# Altium schematic sheet Sheet2.SchDoc
size A3
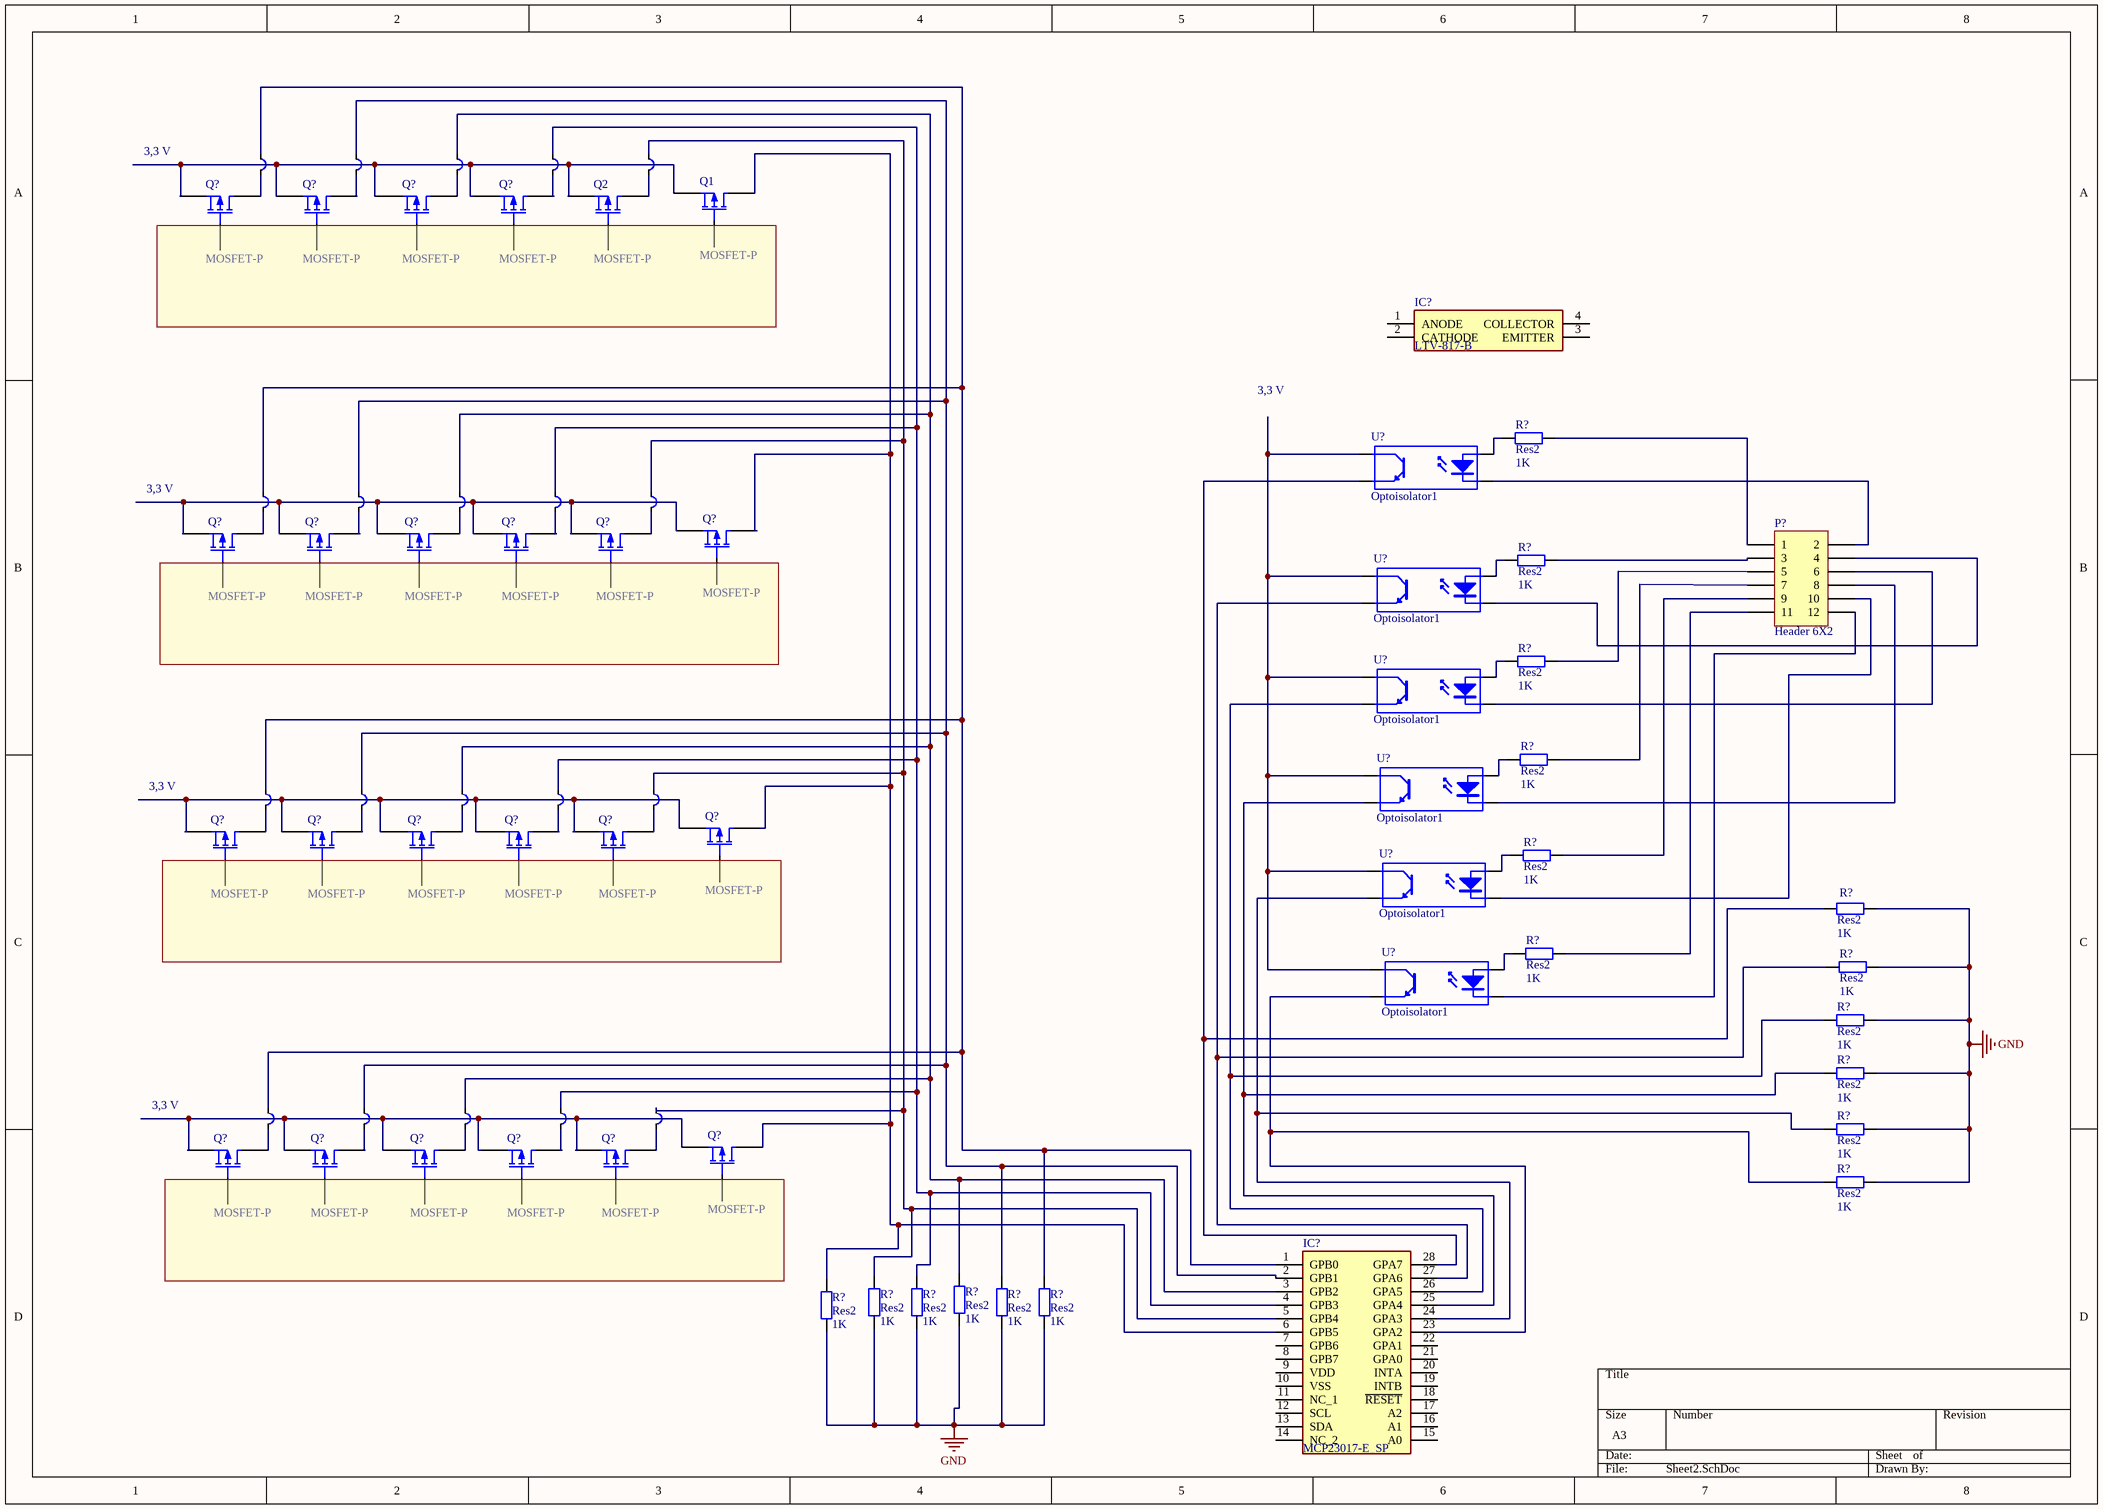
[diagram p0: Sheet2.SchDoc]

## Parts
(Parts that share a designator on the sheet are numbered #1, #2 ... from top to bottom, then left to right.)
*  wire_lope  (value not drawn)
*?#1  wire_lope  (value not drawn)
*?#2  wire_lope  (value not drawn)
*?#3  wire_lope  (value not drawn)
*?#4  wire_lope  (value not drawn)
*?#5  wire_lope  (value not drawn)
*?#6  wire_lope  (value not drawn)
*?#7  wire_lope  (value not drawn)
*?#8  wire_lope  (value not drawn)
*?#9  wire_lope  (value not drawn)
*?#10  wire_lope  (value not drawn)
*?#11  wire_lope  (value not drawn)
*?#12  wire_lope  (value not drawn)
*?#13  wire_lope  (value not drawn)
*?#14  wire_lope  (value not drawn)
*?#15  wire_lope  (value not drawn)
*?#16  wire_lope  (value not drawn)
*?#17  wire_lope  (value not drawn)
*?#18  wire_lope  (value not drawn)
*?#19  wire_lope  (value not drawn)
IC?#1  LTV-817-B  [DIP762W60P254L460H420Q4N]
IC?#2  MCP23017-E_SP  [DIP794W56P254L3486H508Q28N]
P?  Header 6X2  [HDR2X6]
Q1  MOSFET-P  [E3]
Q2  MOSFET-P  [E3]
Q?#1  MOSFET-P  [E3]
Q?#2  MOSFET-P  [E3]
Q?#3  MOSFET-P  [E3]
Q?#4  MOSFET-P  [E3]
Q?#5  MOSFET-P  [E3]
Q?#6  MOSFET-P  [E3]
Q?#7  MOSFET-P  [E3]
Q?#8  MOSFET-P  [E3]
Q?#9  MOSFET-P  [E3]
Q?#10  MOSFET-P  [E3]
Q?#11  MOSFET-P  [E3]
Q?#12  MOSFET-P  [E3]
Q?#13  MOSFET-P  [E3]
Q?#14  MOSFET-P  [E3]
Q?#15  MOSFET-P  [E3]
Q?#16  MOSFET-P  [E3]
Q?#17  MOSFET-P  [E3]
Q?#18  MOSFET-P  [E3]
Q?#19  MOSFET-P  [E3]
Q?#20  MOSFET-P  [E3]
Q?#21  MOSFET-P  [E3]
Q?#22  MOSFET-P  [E3]
R?#1  Res2  value 1K  [AXIAL-0.4]
R?#2  Res2  value 1K  [AXIAL-0.4]
R?#3  Res2  value 1K  [AXIAL-0.4]
R?#4  Res2  value 1K  [AXIAL-0.4]
R?#5  Res2  value 1K  [AXIAL-0.4]
R?#6  Res2  value 1K  [AXIAL-0.4]
R?#7  Res2  value 1K  [AXIAL-0.4]
R?#8  Res2  value 1K  [AXIAL-0.4]
R?#9  Res2  value 1K  [AXIAL-0.4]
R?#10  Res2  value 1K  [AXIAL-0.4]
R?#11  Res2  value 1K  [AXIAL-0.4]
R?#12  Res2  value 1K  [AXIAL-0.4]
R?#13  Res2  value 1K  [AXIAL-0.4]
R?#14  Res2  value 1K  [AXIAL-0.4]
R?#15  Res2  value 1K  [AXIAL-0.4]
R?#16  Res2  value 1K  [AXIAL-0.4]
R?#17  Res2  value 1K  [AXIAL-0.4]
R?#18  Res2  value 1K  [AXIAL-0.4]
U?#1  Optoisolator1  [DIP-4]
U?#2  Optoisolator1  [DIP-4]
U?#3  Optoisolator1  [DIP-4]
U?#4  Optoisolator1  [DIP-4]
U?#5  Optoisolator1  [DIP-4]
U?#6  Optoisolator1  [DIP-4]

## Nets
GND: R?#6.1 R?#8.1 R?#9.1 R?#10.1 R?#11.1 R?#12.1 R?#13.1 R?#14.1 R?#15.1 R?#16.1 R?#17.1 R?#18.1
Net*?#1_6: *?#1.6 *?#5.6 *?#10.6 *?#15.6 IC?#2.1(GPB0) R?#17.2
Net*?#1_7: *?#1.7 Q?#1.1(D)
Net*?#2_6: *?#2.6 *?#6.6 *?#11.6 *?#16.6 IC?#2.2(GPB1) R?#16.2
Net*?#2_7: *?#2.7 Q?#2.1(D)
Net*?#3_6: *?#3.6 *?#7.6 *?#12.6 *?#17.6 IC?#2.3(GPB2) R?#15.2
Net*?#3_7: *?#3.7 Q?#3.1(D)
Net*?#4_6: *?#4.6 *?#9.6 *?#14.6 *?#19.6 IC?#2.5(GPB4) R?#13.2
Net*?#4_7: *?#4.7 Q2.1(D)
Net*?#5_7: *?#5.7 Q?#5.1(D)
Net*?#6_7: *?#6.7 Q?#6.1(D)
Net*?#7_7: *?#7.7 Q?#7.1(D)
Net*?#8_7: *?#8.7 Q?#8.1(D)
Net*?#9_7: *?#9.7 Q?#9.1(D)
Net*?#10_7: *?#10.7 Q?#11.1(D)
Net*?#11_7: *?#11.7 Q?#12.1(D)
Net*?#12_7: *?#12.7 Q?#13.1(D)
Net*?#13_7: *?#13.7 Q?#14.1(D)
Net*?#14_7: *?#14.7 Q?#15.1(D)
Net*?#15_7: *?#15.7 Q?#18.1(D)
Net*?#16_7: *?#16.7 Q?#19.1(D)
Net*?#17_7: *?#17.7 Q?#20.1(D)
Net*?#18_7: *?#18.7 Q?#21.1(D)
Net*?#19_7: *?#19.7 Q?#22.1(D)
Net*_6: *.6 *?#8.6 *?#13.6 *?#18.6 IC?#2.4(GPB3) R?#14.2
Net*_7: *.7 Q?#4.1(D)
NetIC?#2_6: IC?#2.6(GPB5) Q1.1(D) Q?#10.1(D) Q?#16.1(D) Q?#17.1(D) R?#18.2
NetIC?#2_23: IC?#2.23(GPA2) R?#12.2 U?#6.3(E)
NetIC?#2_24: IC?#2.24(GPA3) R?#11.2 U?#5.3(E)
NetIC?#2_25: IC?#2.25(GPA4) R?#10.2 U?#4.3(E)
NetIC?#2_26: IC?#2.26(GPA5) R?#9.2 U?#3.3(E)
NetIC?#2_27: IC?#2.27(GPA6) R?#8.2 U?#2.3(E)
NetIC?#2_28: IC?#2.28(GPA7) R?#6.2 U?#1.3(E)
NetP?_1: P?.1 R?#1.1
NetP?_2: P?.2 U?#1.2(K)
NetP?_3: P?.3 R?#2.1
NetP?_4: P?.4 U?#2.2(K)
NetP?_5: P?.5 R?#3.1
NetP?_6: P?.6 U?#3.2(K)
NetP?_7: P?.7 R?#4.1
NetP?_8: P?.8 U?#4.2(K)
NetP?_9: P?.9 R?#5.1
NetP?_10: P?.10 U?#5.2(K)
NetP?_11: P?.11 R?#7.1
NetP?_12: P?.12 U?#6.2(K)
NetQ1_3: Q1.3(S) Q2.3(S) Q?#1.3(S) Q?#2.3(S) Q?#3.3(S) Q?#4.3(S)
NetQ?#5_3: Q?#5.3(S) Q?#6.3(S) Q?#7.3(S) Q?#8.3(S) Q?#9.3(S) Q?#10.3(S)
NetQ?#11_3: Q?#11.3(S) Q?#12.3(S) Q?#13.3(S) Q?#14.3(S) Q?#15.3(S) Q?#16.3(S)
NetQ?#17_3: Q?#17.3(S) Q?#18.3(S) Q?#19.3(S) Q?#20.3(S) Q?#21.3(S) Q?#22.3(S)
NetR?#1_2: R?#1.2 U?#1.1(A)
NetR?#2_2: R?#2.2 U?#2.1(A)
NetR?#3_2: R?#3.2 U?#3.1(A)
NetR?#4_2: R?#4.2 U?#4.1(A)
NetR?#5_2: R?#5.2 U?#5.1(A)
NetR?#7_2: R?#7.2 U?#6.1(A)
NetU?#1_4: U?#1.4(C) U?#2.4(C) U?#3.4(C) U?#4.4(C) U?#5.4(C) U?#6.4(C)

Not connected (* = marked no-connect by the designer): IC?#1 1(ANODE) 2(CATHODE) 3(EMITTER) 4(COLLECTOR); IC?#2 7(GPB6) 8(GPB7) 9(VDD) 10(VSS) 11(NC_1) 12(SCL) 13(SDA) 14(NC_2) 15(A0) 16(A1) 17(A2) 18(~{RESET}) 19(INTB) 20(INTA) 21(GPA0) 22(GPA1); Q1 2(G); Q2 2(G); Q?#1 2(G); Q?#2 2(G); Q?#3 2(G); Q?#4 2(G); Q?#5 2(G); Q?#6 2(G); Q?#7 2(G); Q?#8 2(G); Q?#9 2(G); Q?#10 2(G); Q?#11 2(G); Q?#12 2(G); Q?#13 2(G); Q?#14 2(G); Q?#15 2(G); Q?#16 2(G); Q?#17 2(G); Q?#18 2(G); Q?#19 2(G); Q?#20 2(G); Q?#21 2(G); Q?#22 2(G)

## Notes on the sheet
- (near Q?#1) 3,3 V
- 3,3 V
- (near Q?#5) 3,3 V
- (near Q?#11) 3,3 V
- (near Q?#18) 3,3 V

## Library data of the parts
IC?#1 = LTV-817-B: Integrated Circuit; Manufacturer_Name: Lite-On; Datasheet Link: http://optoelectronics.liteon.com/upload/download/DS-70-96-0016/LTV-8X7%20series%20201610%20.pdf; Height: 4.2mm; Manufacturer_Part_Number: LTV-817-B; Mouser Part Number: N/A; Mouser Price/Stock: https://www.mouser.co.uk/ProductDetail/Lite-On/LTV-817-B?qs=5Clb0NIqk7HzP4M9tIz87Q%3D%3D; Arrow Part Number: LTV-817-B; Arrow Price/Stock: https://www.arrow.com/en/products/ltv-817-b/lite-on-technology
IC?#2 = MCP23017-E_SP: Integrated Circuit; Manufacturer_Name: Microchip; Manufacturer_Part_Number: MCP23017-E/SP; Datasheet Link: http://docs-emea.rs-online.com/webdocs/137e/0900766b8137eed4.pdf; Height: 5.08mm; Mouser Part Number: 579-MCP23017-E/SP; Mouser Price/Stock: https://www.mouser.co.uk/ProductDetail/Microchip-Technology/MCP23017-E-SP?qs=usxtMOJb1RyESXZDw7ia5A%3D%3D; Arrow Part Number: MCP23017-E/SP; Arrow Price/Stock: https://www.arrow.com/en/products/mcp23017-esp/microchip-technology
P? = Header 6X2: Header, 6-Pin, Dual row; LatestRevisionDate: 17-Jul-2002; LatestRevisionNote: Re-released for DXP Platform.; Publisher: Altium Limited
Q1 Q2 Q?#1-Q?#22 = MOSFET-P: P-Channel MOSFET; Published: 8-Jun-2000; LatestRevisionDate: 17-Jul-2002; LatestRevisionNote: Re-released for DXP Platform.; PackageVersion: 1995/1996; PackageReference: E3; Publisher: Altium Limited; PackageDescription: TO, Flat Index; 3 In-Line, Axial Leads; Body Dia. 4.6mm; Lead Dia. 0.5 mm (max)
R?#1-R?#18 = Res2: Resistor; Published: 8-Jun-2000; LatestRevisionDate: 17-Jul-2002; LatestRevisionNote: Re-released for DXP Platform.; PackageReference: AXIAL-0.4; Publisher: Altium Limited; PackageDescription: Axial Device, Thru-Hole; 2 Leads; 0.4 in Pin Spacing
U?#1-U?#6 = Optoisolator1: 4-Pin Phototransistor Optocoupler; Published: 24-Mar-1999; LatestRevisionDate: 04-Mar-2005; LatestRevisionNote: Sch pins 3 & 4 Swapped.; DatasheetVersion: Nov-2003; PackageReference: DIP-4; Publisher: Altium Limited